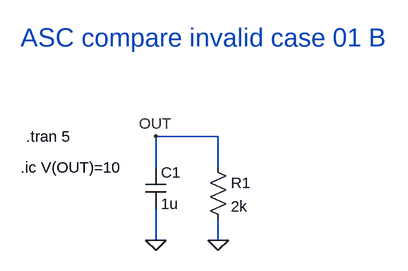
[diagram p0: schematic invalid_case_01_b.asc]
invalid_case_01_b.asc, the LTspice schematic file:
Version 4.1
SHEET 1 880 680
WIRE 208 64 112 64
WIRE 112 112 112 64
WIRE 208 112 208 64
WIRE 112 224 112 176
WIRE 208 224 208 192
FLAG 208 224 0
FLAG 112 224 0
FLAG 112 64 OUT
SYMBOL cap 96 112 R0
SYMATTR InstName C1
SYMATTR Value 1u
SYMBOL res 192 96 R0
SYMATTR InstName R1
SYMATTR Value 2k
TEXT -96 112 Left 2 !.ic V(OUT)=10
TEXT -88 64 Left 2 !.tran 5
TEXT -96 -88 Left 4 ;ASC compare invalid case 01 B

The netlist it stands for:
* invalid_case_01_b.asc
C1 OUT 0 1u
R1 OUT 0 2k
.ic V(OUT)=10
.tran 5
* ASC compare invalid case 01 B
.backanno
.end